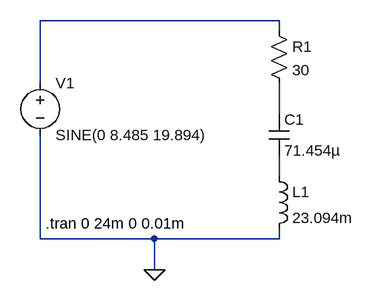
[diagram p0: schematic Lab3_1_6.asc]
Lab3_1_6.asc, the LTspice schematic file:
Version 4
SHEET 1 880 680
WIRE 448 16 80 16
WIRE 448 32 448 16
WIRE 80 112 80 16
WIRE 448 160 448 112
WIRE 448 256 448 224
WIRE 80 352 80 192
WIRE 256 352 80 352
WIRE 448 352 448 336
WIRE 448 352 256 352
WIRE 256 400 256 352
FLAG 256 400 0
SYMBOL voltage 80 96 R0
WINDOW 123 0 0 Left 0
WINDOW 39 0 0 Left 0
SYMATTR InstName V1
SYMATTR Value SINE(0 8.485 19.894)
SYMBOL res 432 16 R0
SYMATTR InstName R1
SYMATTR Value 30
SYMBOL cap 432 160 R0
SYMATTR InstName C1
SYMATTR Value 71.454µ
SYMBOL ind 432 240 R0
SYMATTR InstName L1
SYMATTR Value 23.094m
SYMATTR SpiceLine Rser=5
TEXT 88 328 Left 2 !.tran 0 24m 0 0.01m

The netlist it stands for:
* Lab3_1_6.asc
V1 N001 0 SINE(0 8.485 19.894)
R1 N001 N002 30
C1 N002 N003 71.454µ
L1 N003 0 23.094m Rser=5
.tran 0 24m 0 0.01m
.backanno
.end